# Altium schematic sheet igniter.SchDoc
size A
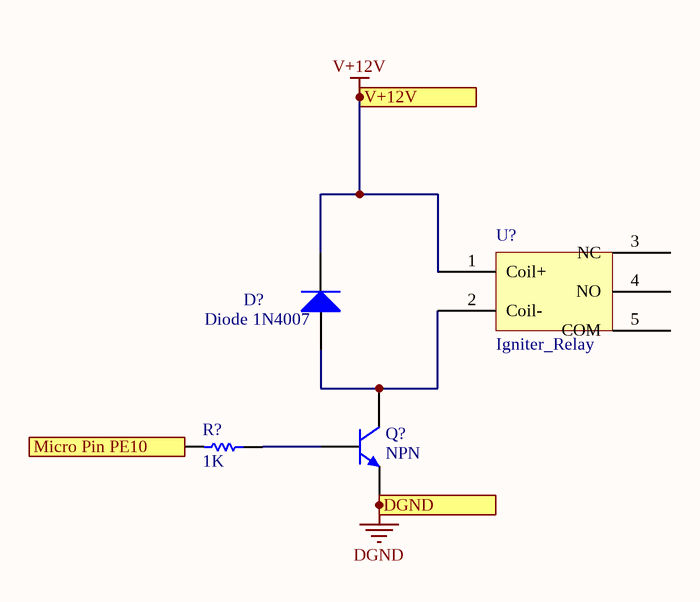
[diagram p0: igniter.SchDoc]

## Parts
D?  Diode 1N4007  [DO-41]
Q?  NPN  [TO-226-AA]
R?  1K  [R0805]
U?  Igniter_Relay

## Ports
DGND, Micro Pin PE10, V+12V

## Nets
DGND: Q?.3(E) ; port DGND
V+12V: D?.2(K) U?.1(Coil+) ; port V+12V
Micro Pin PE10: R?.2 ; port Micro Pin PE10
NetD?_1: D?.1(A) Q?.1(C) U?.2(Coil-)
NetQ?_2: Q?.2(B) R?.1

Not connected (* = marked no-connect by the designer): U? 3(NC) 4(NO) 5(COM)

## Library data of the parts
D? = Diode 1N4007: 1 Amp General Purpose Rectifier; Published: 8-Jun-2000; LatestRevisionDate: 17-Jul-2002; LatestRevisionNote: Re-released for DXP Platform.; DatasheetVersion: 1998; PackageVersion: Aug-1999; PackageReference: DO-41; Publisher: Altium Limited; PackageDescription: Diode, Axial; Body 5.2 x 2.7 mm (LxDia. max), Lead Dia. 0.86 mm (max); Code_JEDEC: DO-204-AL; ComponentLink1Description: Manufacturer Link; ComponentLink1URL: http://www.fairchildsemi.com/; ComponentLink2Description: Datasheet; ComponentLink2URL: http://www.fairchildsemi.com/ds/1N%2F1N4001.pdf
Q? = NPN: NPN Bipolar Transistor; Published: 8-Jun-2000; LatestRevisionDate: 17-Jul-2002; LatestRevisionNote: Re-released for DXP Platform.; PackageReference: TO-226-AA; Publisher: Altium Limited; PackageDescription: TO, Flat Index; 3 In-Line, Axial Leads; Body Dia. 4.8mm; Leads 0.55 x 0.51 mm (max); Code_JEDEC: TO-226-AA
R? = R0805: RESISTOR 0805; Value: 1K